# EasyEDA schematic raiden_application.json
TITLE: Raiden application by Grzegorz Wypych (h0rac); REV: 1.0; Date: 2019-12-05; Sheet: 1/1; Company: IBM X-Force Red
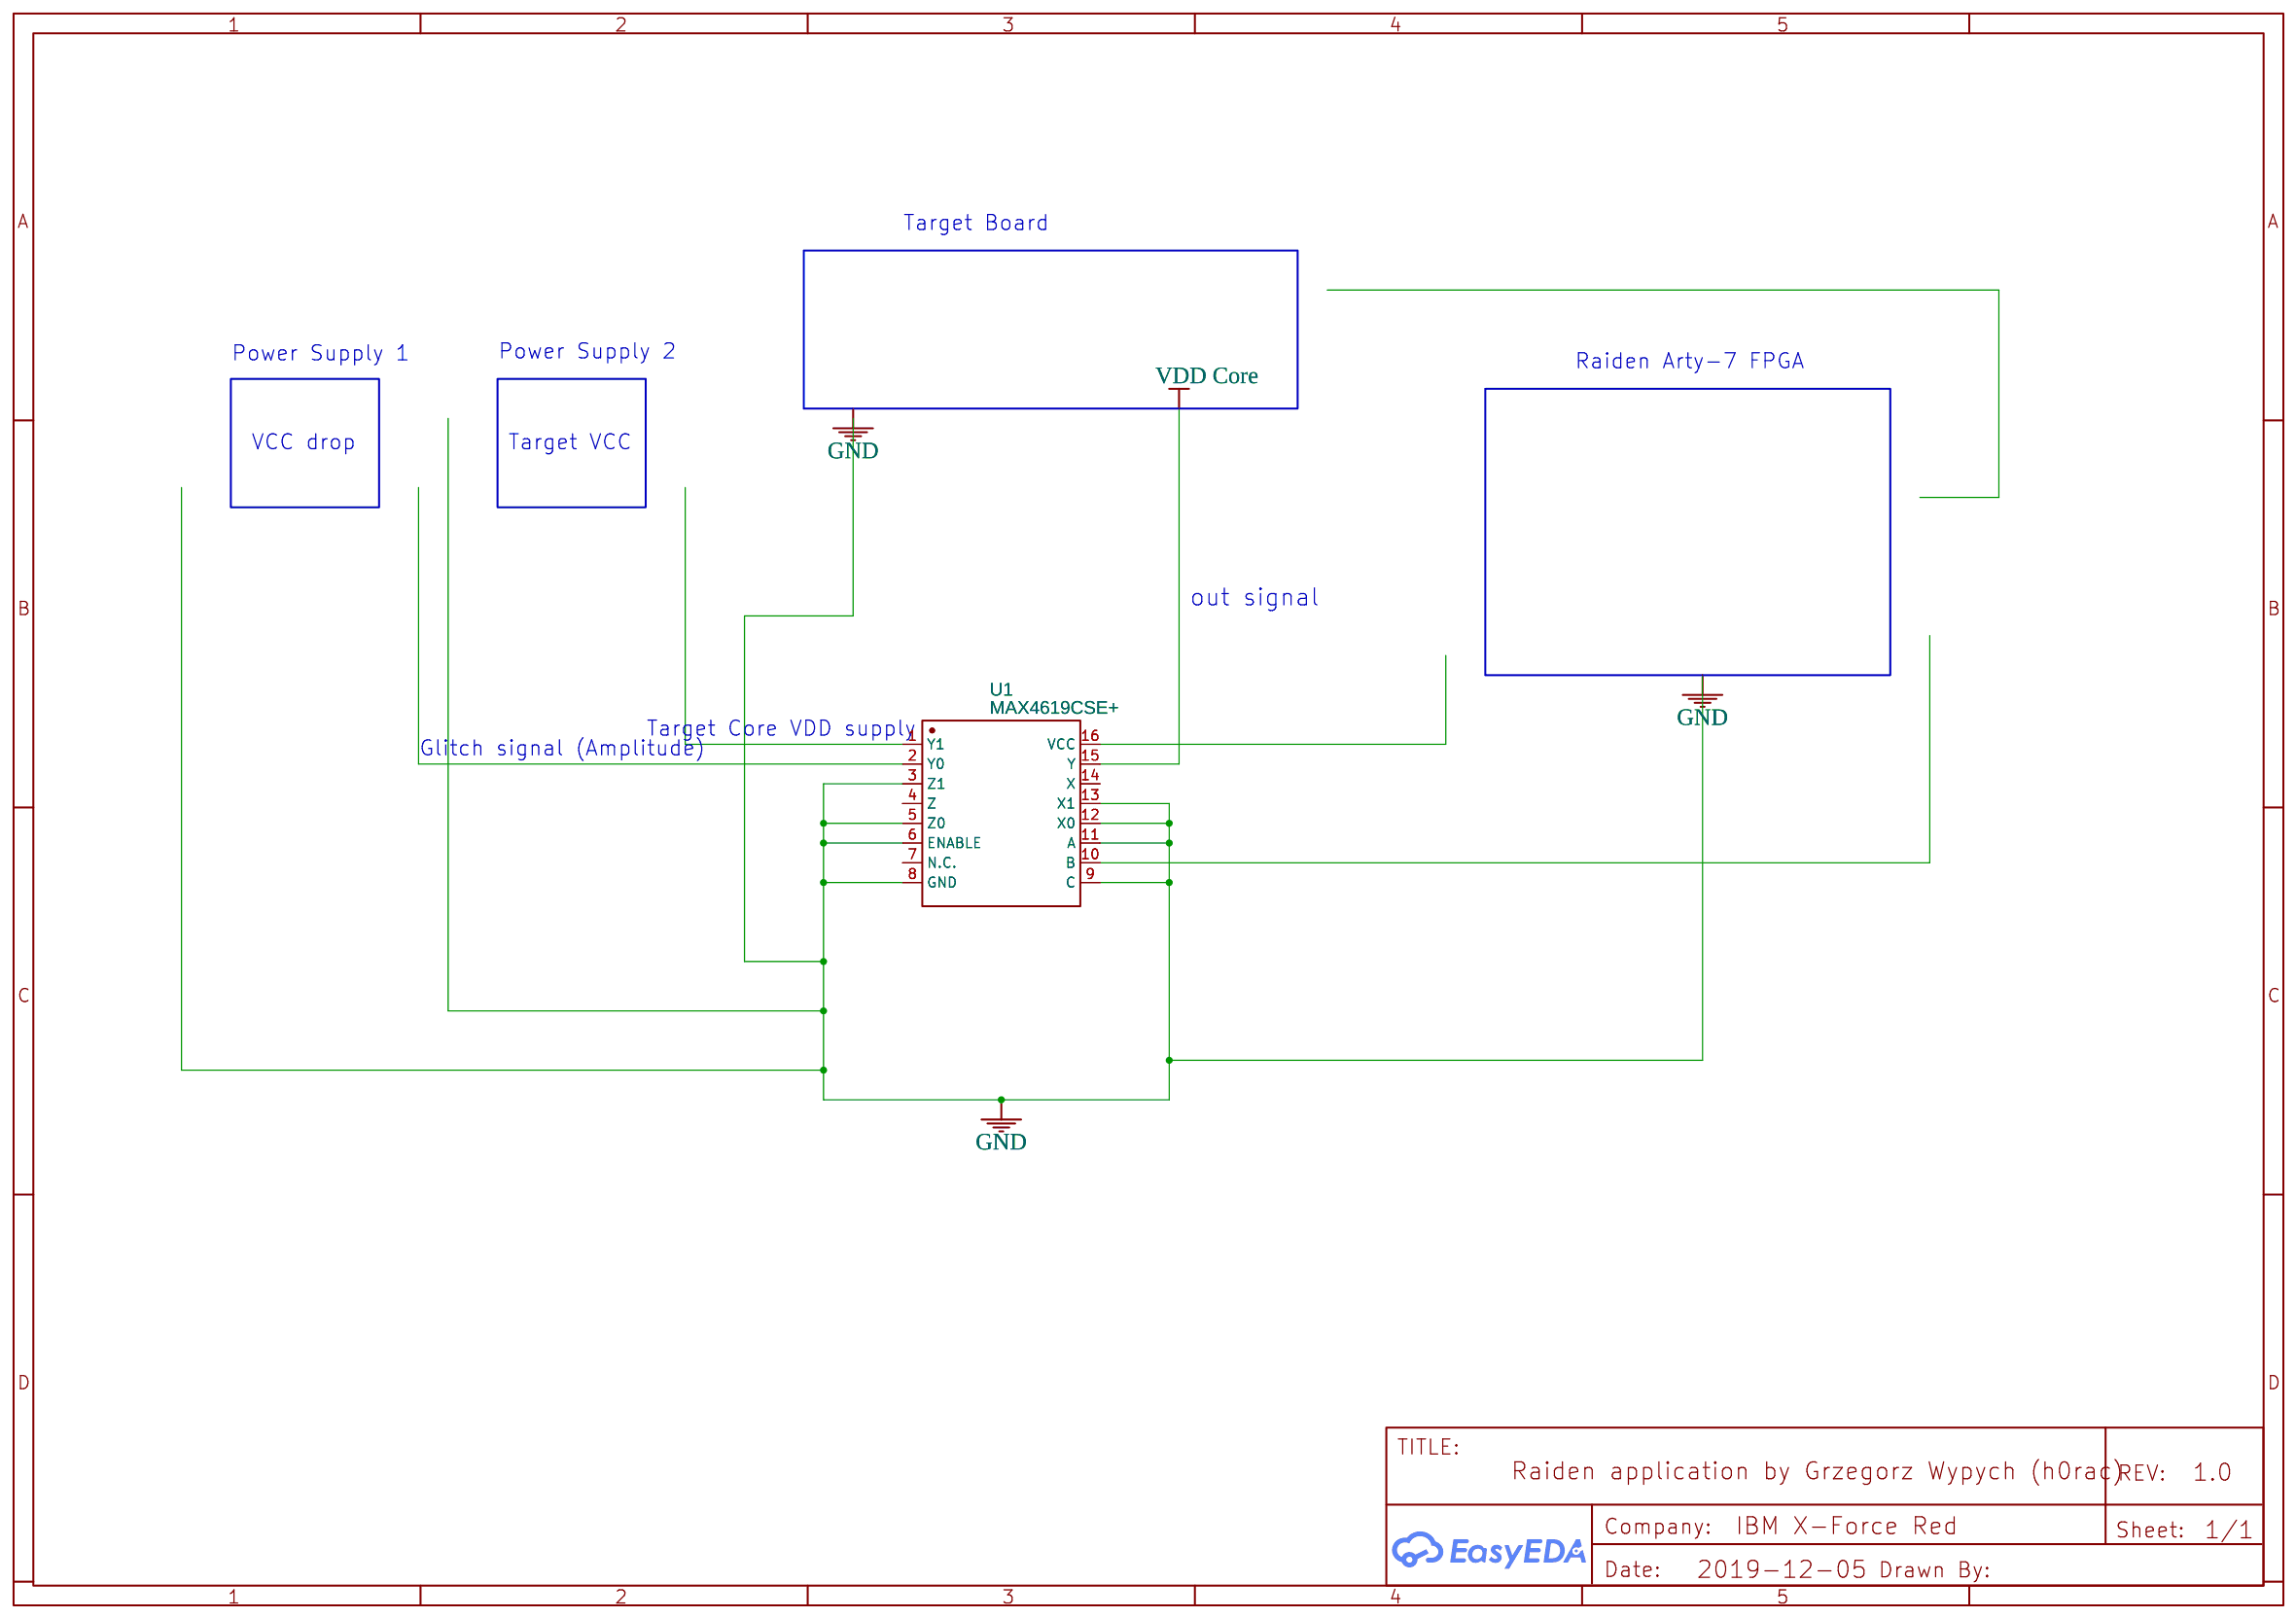
[diagram p0: schematic sheet]

## Parts
U1  MAX4619CSE+  [SOIC-16_150MIL]

## Library data of the parts
U1 = -: Supplier: LCSC; Manufacturer: MAXIM; Manufacturer Part: MAX4617CSE+; Contributor: LCSC; Supplier Part: C143482

## Nets
GND: U1.3(Z1) U1.5(Z0) U1.6(ENABLE) U1.8(GND) U1.9(C) U1.11(A) U1.12(X0) U1.13(X1)
VDD Core: U1.15(Y)

Not connected (* = marked no-connect by the designer): U1 1(Y1) 2(Y0) 4(Z) 7(N.C.) 10(B) 14(X) 16(VCC)

## Notes on the sheet
- Target Board
- Power Supply 1
- Power Supply 2
- Raiden Arty-7 FPGA
- VCC drop
- Target VCC
- out signal
- Target Core VDD supply
- Glitch signal (Amplitude)
